# EAGLE design Makeyduino (EAGLE 5.07)
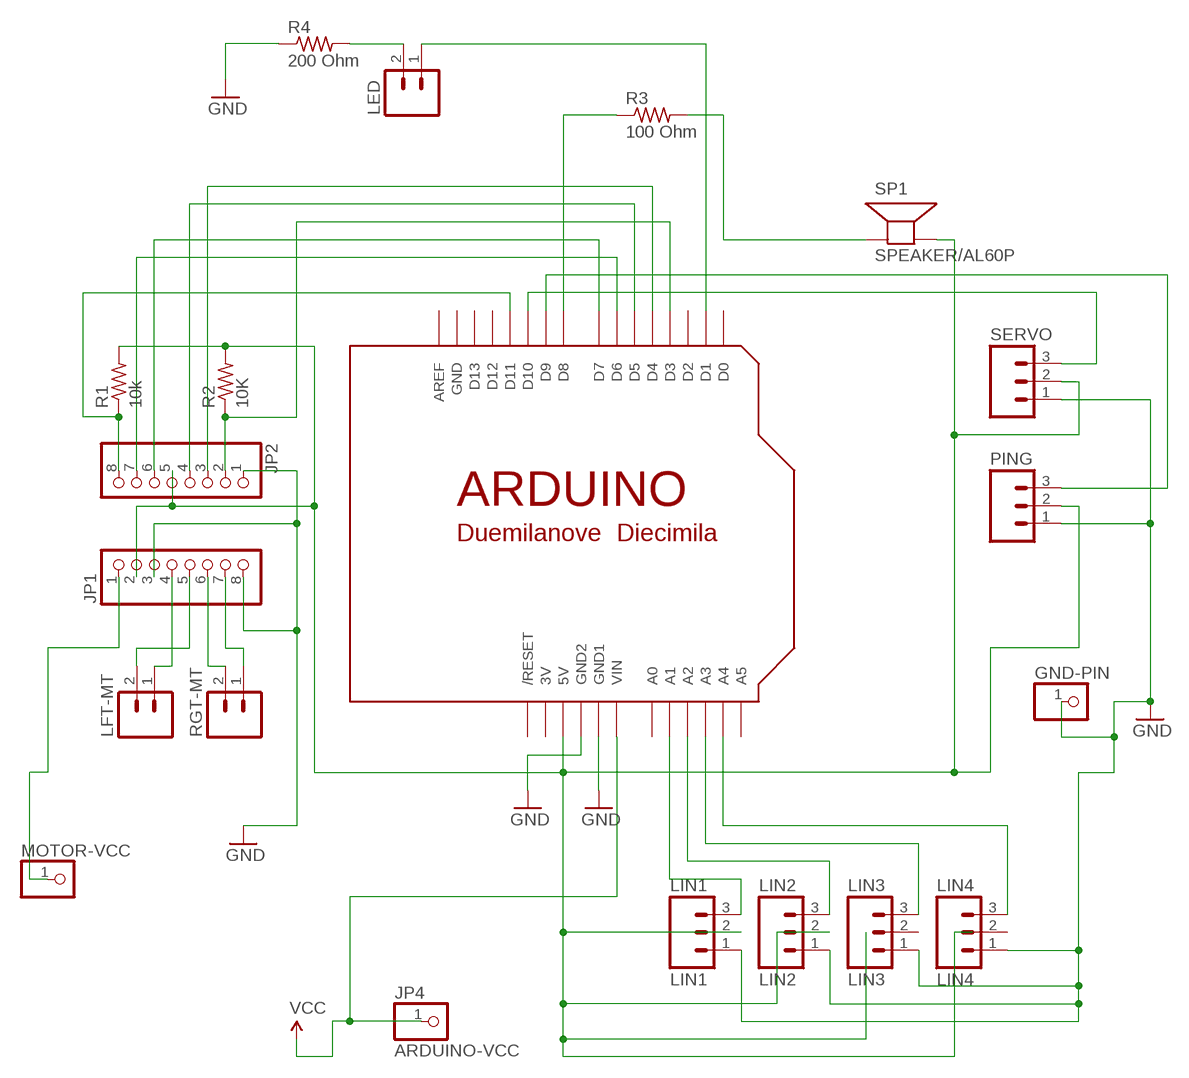
[diagram p0: schematic, sheet 1]

## Parts
GND-PIN  PINHD-1X1  [1X01]
JP1  PINHD-1X8CLEANBIG  [1X08-CLEANBIG]
JP2  PINHD-1X8CLEANBIG  [1X08-CLEANBIG]
JP4  ARDUINO-VCC  PINHD-1X1  [1X01]
LED  M02POLAR  [MOLEX-1X2]
LFT-MT  M02POLAR  [MOLEX-1X2]
LIN1  LIN1  M03POLAR  [MOLEX-1X3]
LIN2  LIN2  M03POLAR  [MOLEX-1X3]
LIN3  LIN3  M03POLAR  [MOLEX-1X3]
LIN4  LIN4  M03POLAR  [MOLEX-1X3]
MOTOR-VCC  PINHD-1X1  [1X01]
PING  M03POLAR  [MOLEX-1X3]
R1  10k  R-US_0207/10  [0207/10]
R2  10K  R-US_0207/10  [0207/10]
R3  100 Ohm  R-US_0207/2V  [0207/2V]
R4  200 Ohm  R-US_0207/2V  [0207/2V]
RGT-MT  M02POLAR  [MOLEX-1X2]
SERVO  M03POLAR  [MOLEX-1X3]
SP1  SPEAKER/AL60P  [AL60P]
U$1  ARDUINO-NOHOLE  [ARDUINO-NOHOLE]

## Nets
GND: GND-PIN.1 JP1.3 JP1.8 JP2.1 LIN1.1 LIN2.1 LIN3.1 LIN4.1 PING.1 R4.1 SERVO.1 U$1.GND1 U$1.GND2
N$1: LIN1.3 U$1.A1
N$2: LIN2.3 U$1.A2
N$3: LIN3.3 U$1.A3
N$4: LIN4.3 U$1.A4
N$5: JP2.2 R2.1 U$1.D3
N$6: JP2.8 R1.1 U$1.D11
N$7: SERVO.3 U$1.D10
N$8: PING.3 U$1.D9
N$9: JP1.2 JP2.5 LIN1.2 LIN2.2 PING.2 R1.2 R2.2 SERVO.2 SP1.2(-) U$1.5V
N$10: JP2.4 U$1.D5
N$11: JP1.7 RGT-MT.1
N$12: JP1.6 RGT-MT.2
N$13: JP1.5 LFT-MT.2
N$14: JP1.4 LFT-MT.1
N$15: JP2.3 U$1.D4
N$16: R3.2 SP1.1(+)
N$17: JP1.1 MOTOR-VCC.1
N$18: JP2.7 U$1.D6
N$19: JP2.6 U$1.D7
N$20: R3.1 U$1.D8
N$21: LED.2 R4.2
N$22: LED.1 U$1.D1
VCC: JP4.1 U$1.VIN
Unconnected: LIN3.2 LIN4.2 U$1.A0 U$1.A5 U$1.AREF U$1.D0 U$1.D2 U$1.D12 U$1.D13 U$1.RESET(/RESET)

## Power pins joined to a net without a drawn wire
3V: U$1.3V
GND: U$1.GND

## Library data of the parts
GND-PIN JP4 MOTOR-VCC = adafruit:PINHD-1X1: Pin header 1x1 for 0.1" spacing With round pins
JP1 JP2 = adafruit:PINHD-1X8: PIN HEADER
LED LFT-MT RGT-MT = SparkFun:M02: Header 2 Standard 2-pin 0.1" header. Use with straight break away headers (SKU : PRT-00116), right angle break away headers (PRT-00553), swiss pins (PRT-00743), machine pins (PRT-00117), and female headers (PRT-00115). Molex polarized connector foot print use with SKU : PRT-08233 with associated crimp pins and housings.
LIN1-LIN4 PING SERVO = SparkFun:M03: Header 3 Standard 3-pin 0.1" header. Use with straight break away headers (SKU : PRT-00116), right angle break away headers (PRT-00553), swiss pins (PRT-00743), machine pins (PRT-00117), and female headers (PRT-00115). Molex polarized connector foot print use with SKU : PRT-08232 with associated crimp pins and housings.
R1-R4 = adafruit:R-US_: RESISTOR, American symbol
SP1 = adafruit:SPEAKER: SPEAKER Source: Buerklin Added PS12 (for part # PS1240 piezo) http://www.ladyada.net/library/pcb/eaglelibrary.html
U$1 = adafruit:ARDUINO: Arduino Diecimila/Duemilanove Make a shield with ease, this package has all the named pins as well as the two mounting drill holes and an outline of the USB and DC power connector. The outline is on the DIMENSION layer, so if your board house uses it they will cut the outline to match. http://www.ladyada.net/library/pcb/eaglelibrary.html

## Board
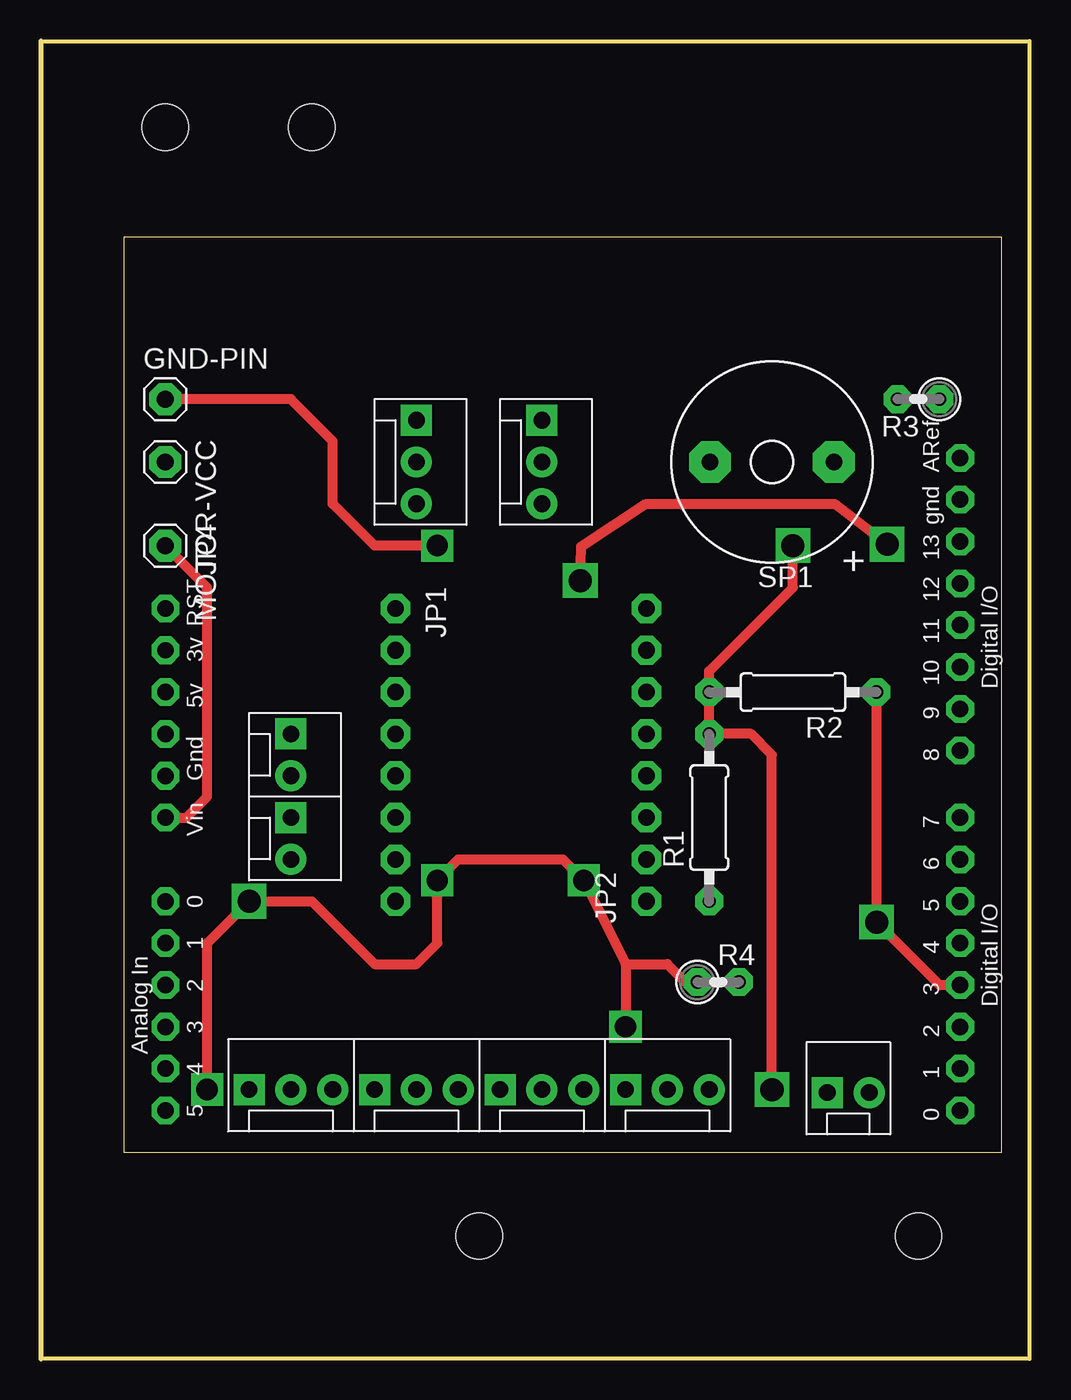
[diagram p1: board, top side]
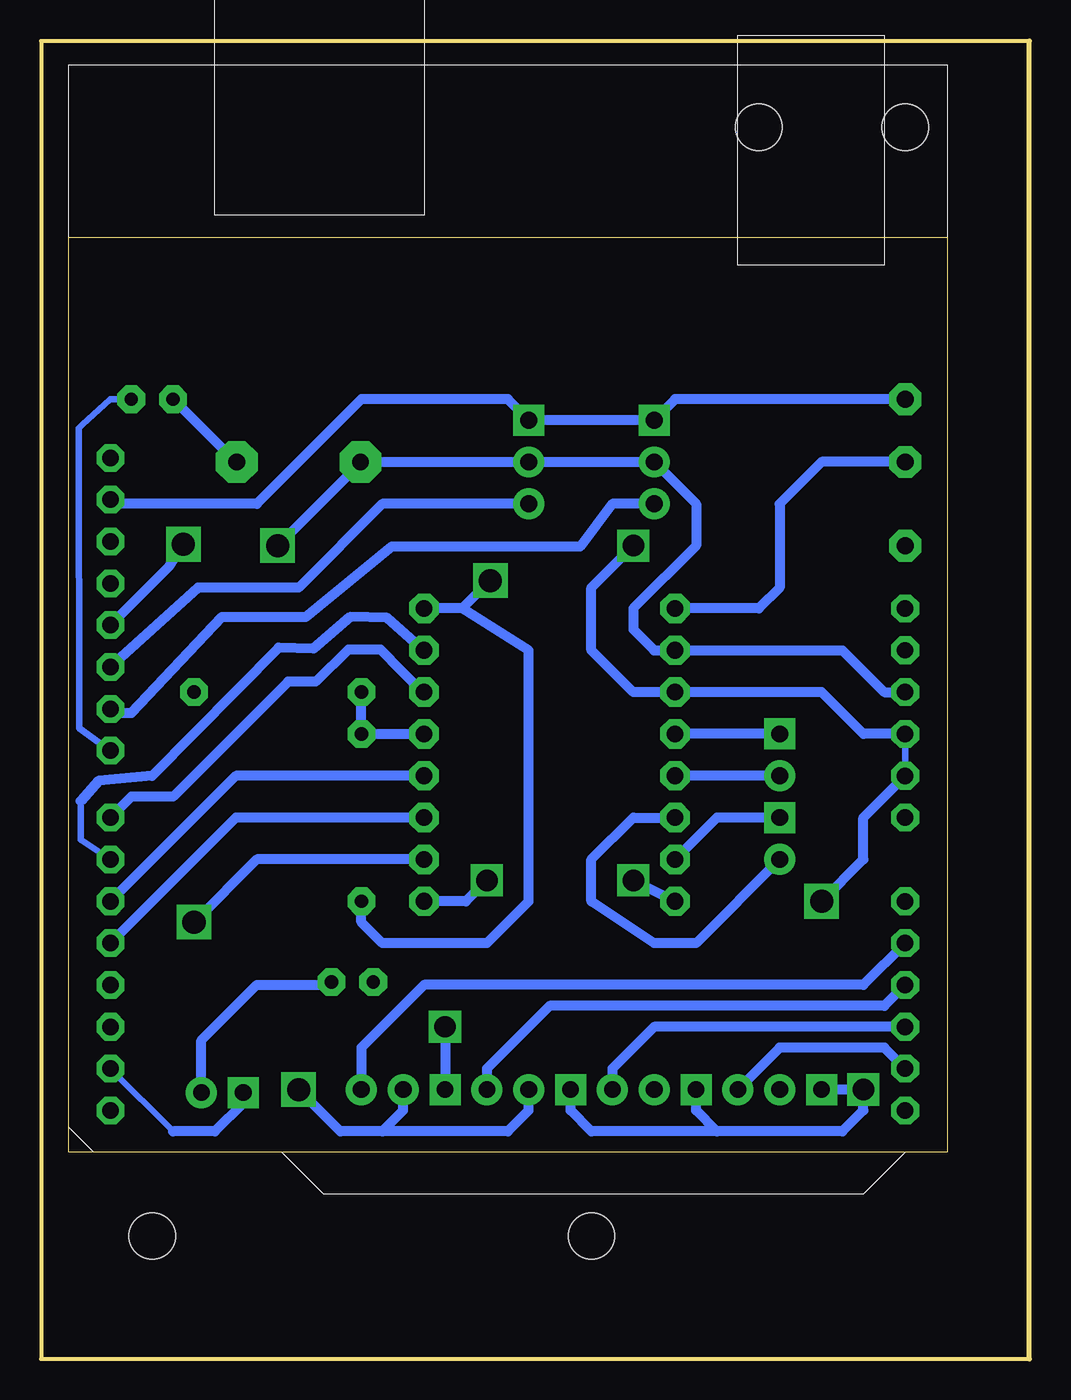
[diagram p2: board, bottom side, seen from below]

Size 60 x 80 mm. Coordinates in mm from the lower left corner, seen from the top.
Outline: 5,12.54 58.32,12.54 58.32,68.09 5,68.09 5,12.54
Outline: 0,0 0,80 60,80 60,0 0,0
Copper layers (1*16): Top 0.0356mm / dielectric 1.5011mm / Bottom 0.0356mm
Design rules "LaenPCBOrder": minimum track width 6mil, minimum drill 13mil, track to track 6mil, track to pad 6mil, pad to pad 6mil, via to via 6mil, smd to smd 6mil, copper to edge 15mil, drill to drill 6mil, minimum pad ring 7mil, minimum via ring 7mil, stop-mask expansion 4mil, vias tented up to drill 0mil, thermal gap 10mil
Holes 2.8 mm at 7.54,74.77 16.43,74.77 26.59,7.46 53.26,7.46

### Footprints (pad centres in the part's own frame; a part is rotated, then mirrored left to right if it is on the bottom)
1X01 = drill 1.016 pad 1.93 octagon: 1 0,0
1X08-CLEANBIG = drill 1.016 pad 1.778 octagon: 1 -8.89,0; 2 -6.35,0; 3 -3.81,0; 4 -1.27,0; 5 1.27,0; 6 3.81,0; 7 6.35,0; 8 8.89,0
MOLEX-1X2 = drill 1.016 pad 1.88 square: 1 0,0 | drill 1.016 pad 1.88 round: 2 2.54,0
MOLEX-1X3 = drill 1.016 pad 1.88 square: 1 0,0 | drill 1.016 pad 1.88 round: 2 2.54,0; 3 5.08,0
0207/10 = drill 0.813 pad 1.676 octagon: 1 -5.08,0; 2 5.08,0
0207/2V = drill 0.813 pad 1.676 octagon: 1 -1.27,0; 2 1.27,0
AL60P = drill 1.016 pad 2.54 octagon: 1 -3.759,0; 2 3.759,0
ARDUINO-NOHOLE = drill 1 pad 1.676 octagon: 3V 35.56,2.54; 5V 38.1,2.54; A0 50.8,2.54; A1 53.34,2.54; A2 55.88,2.54; A3 58.42,2.54; A4 60.96,2.54; A5 63.5,2.54; AREF 23.876,50.8; D0 63.5,50.8; D1 60.96,50.8; D2 58.42,50.8; D3 55.88,50.8; D4 53.34,50.8; D5 50.8,50.8; D6 48.26,50.8; D7 45.72,50.8; D8 41.656,50.8; D9 39.116,50.8; D10 36.576,50.8; D11 34.036,50.8; D12 31.496,50.8; D13 28.956,50.8; GND 26.416,50.8; GND1 43.18,2.54; GND2 40.64,2.54; RESET 33.02,2.54; VIN 45.72,2.54

### Placement (x,y rotation side)
GND-PIN  7.54,58.26 0 top
JP1  21.51,36.67 270 top
JP2  36.75,36.67 90 top
JP4  7.54,49.37 270 top
LED  47.73,16.17 0 top
LFT-MT  15.16,37.94 270 top
LIN1  35.48,16.35 0 top
LIN2  27.86,16.35 0 top
LIN3  20.24,16.35 0 top
LIN4  12.62,16.35 0 top
MOTOR-VCC  7.54,54.45 270 top
PING  22.78,56.99 270 top
R1  40.56,32.86 90 top
R2  45.64,40.48 180 top
R3  53.26,58.26 180 top
R4  41.11,22.87 0 top
RGT-MT  15.16,32.86 270 top
SERVO  30.4,56.99 270 top
SP1  44.37,54.45 180 top
U$1  5,78.58 270 top

### Tracks (layer width: path | path; a pad name or v marks a point on that pad's centre or on a via)
GND  (via drill 1.3, 1.3 pad 0.25, 1.4)
  Top 0.61: v10.08,16.35 10.08,25.24 v12.62,27.78 16.43,27.78 20.24,23.97 22.78,23.97 24.05,25.24 v24.05,29.05 25.32,30.32 31.67,30.32 v32.94,29.05 35.48,23.97 | GND-PIN.1 15.16,58.26 17.7,55.72 17.7,51.91 20.24,49.37 v24.05,49.37 | 35.48,23.97 v35.48,20.16 | R4.1 39.12,22.88 38.02,23.97 35.48,23.97
  Bottom 0.406: U$1.GND1 U$1.GND2
  Bottom 0.61: GND-PIN.1 21.51,58.26 PING.1 SERVO.1 31.67,58.26 40.56,58.26 46.91,51.91 55.55,51.91 U$1.GND | U$1.GND2 10.08,37.94 12.62,40.48 JP1.3 24.05,40.48 26.59,43.02 26.59,46.83 v24.05,49.37 | v12.62,27.78 10.08,30.32 10.08,32.86 U$1.GND1 | 18.97,13.81 11.35,13.81 10.08,15.08 v10.08,16.35 LIN4.1 | 18.97,13.81 26.59,13.81 27.86,15.08 LIN2.1 | LIN3.1 20.24,15.08 18.97,13.81 | v35.48,20.16 LIN1.1 | JP2.1 34.21,27.78 v32.94,29.05 | v24.05,29.05 JP1.8
N$1
  Bottom 0.61: LIN1.3 40.56,18.89 36.75,22.7 10.08,22.7 U$1.A1
N$2
  Bottom 0.61: LIN2.3 32.94,17.62 29.13,21.43 8.81,21.43 U$1.A2
N$3
  Bottom 0.61: LIN3.3 25.32,17.62 22.78,20.16 U$1.A3
N$4
  Bottom 0.61: LIN4.3 15.16,18.89 8.81,18.89 U$1.A4
N$5  (via drill 1.4)
  Top 0.61: U$1.D3 54.53,22.7 v50.72,26.51 R2.1
  Bottom 0.61: v50.72,26.51 46.91,30.32 JP2.2
N$6  (via drill 1.4)
  Top 0.61: v32.73,47.25 32.78,49.32 36.75,51.91 48.18,51.91 v51.37,49.46
  Bottom 0.61: R1.1 40.56,26.51 39.29,25.24 32.94,25.24 30.4,27.78 30.4,43.02 34.42,45.56 | 34.42,45.56 JP2.8 | 34.42,45.56 v32.73,47.25 | v51.37,49.46 52.24,48.1 U$1.D11
N$7
  Bottom 0.61: U$1.D10 50.49,46.83 44.37,46.83 39.29,51.91 SERVO.3
N$8
  Bottom 0.61: PING.3 25.32,51.91 27.28,49.32 38.71,49.32 43.94,45.03 49.03,45.03 54.53,39.21 55.55,39.21 U$1.D9
N$9  (via drill 1.4)
  Top 0.61: v45.64,49.37 45.64,46.83 40.56,41.75 R2.2 R1.2 43.1,37.94 44.37,36.67 v44.37,16.35
  Bottom 0.61: R2.2 R1.2 JP2.5 | LIN2.2 30.4,15.08 31.67,13.81 39.29,13.81 | U$1.5V 8.81,40.48 11.35,43.02 JP1.2 22.78,43.02 24.05,44.29 24.05,45.56 20.24,49.37 20.24,51.91 PING.2 SERVO.2 SP1.2 40.61,54.4 v45.64,49.37 | v44.37,16.35 41.83,13.81 39.29,13.81 | LIN1.2 38.02,15.08 39.29,13.81
N$10
  Bottom 0.61: JP2.4 48.18,35.4 U$1.D5
N$11
  Bottom 0.61: RGT-MT.1 18.97,32.86 JP1.7
N$12
  Bottom 0.61: RGT-MT.2 20.24,25.24 22.78,25.24 26.59,27.78 26.59,30.32 24.05,32.86 JP1.6
N$13
  Bottom 0.61: LFT-MT.2 JP1.5
N$14
  Bottom 0.61: LFT-MT.1 JP1.4
N$15
  Bottom 0.61: JP2.3 48.18,32.86 U$1.D4
N$16
  Bottom 0.406: SP1.1 48.18,54.45
  Bottom 0.61: 48.18,54.45 R3.2
N$17
  Bottom 0.61: MOTOR-VCC.1 12.62,54.45 15.16,51.91 15.16,46.83 16.43,45.56 JP1.1
N$18
  Bottom 0.406: 57.6,33.87 57.6,31.5 U$1.D6
  Bottom 0.61: 57.6,33.87 56.51,35.09 53.26,35.4 45.59,43.18 43.47,43.13 41.23,45.04 38.98,44.99 37.05,43.28 JP2.7
N$19
  Bottom 0.61: JP2.6 36.81,40.41 39.38,43.06 41.35,43.06 43.34,41.11 45,41.11 51.99,34.13 54.53,34.13 U$1.D7
N$20
  Bottom 0.406: R3.1 55.8,58.26 57.51,56.72 57.73,56.51 57.7,38.3 U$1.D8
N$21
  Bottom 0.61: LED.2 50.27,19.34 46.91,22.7 42.55,22.7 R4.2
N$22
  Bottom 0.406: U$1.D1 51.99,13.81
  Bottom 0.61: LED.1 47.73,15.53 49.45,13.81 51.99,13.81
VCC
  Top 0.61: U$1.VIN 8.81,32.86 10.08,34.13 10.08,46.83 JP4.1

### Text on the board
tNames: +
tTest: Makey-duino 1.0 | jul-2011
bTest: Makey-duino 1.0 | jul-2011